# EAGLE design untitled (EAGLE 9.6.2)
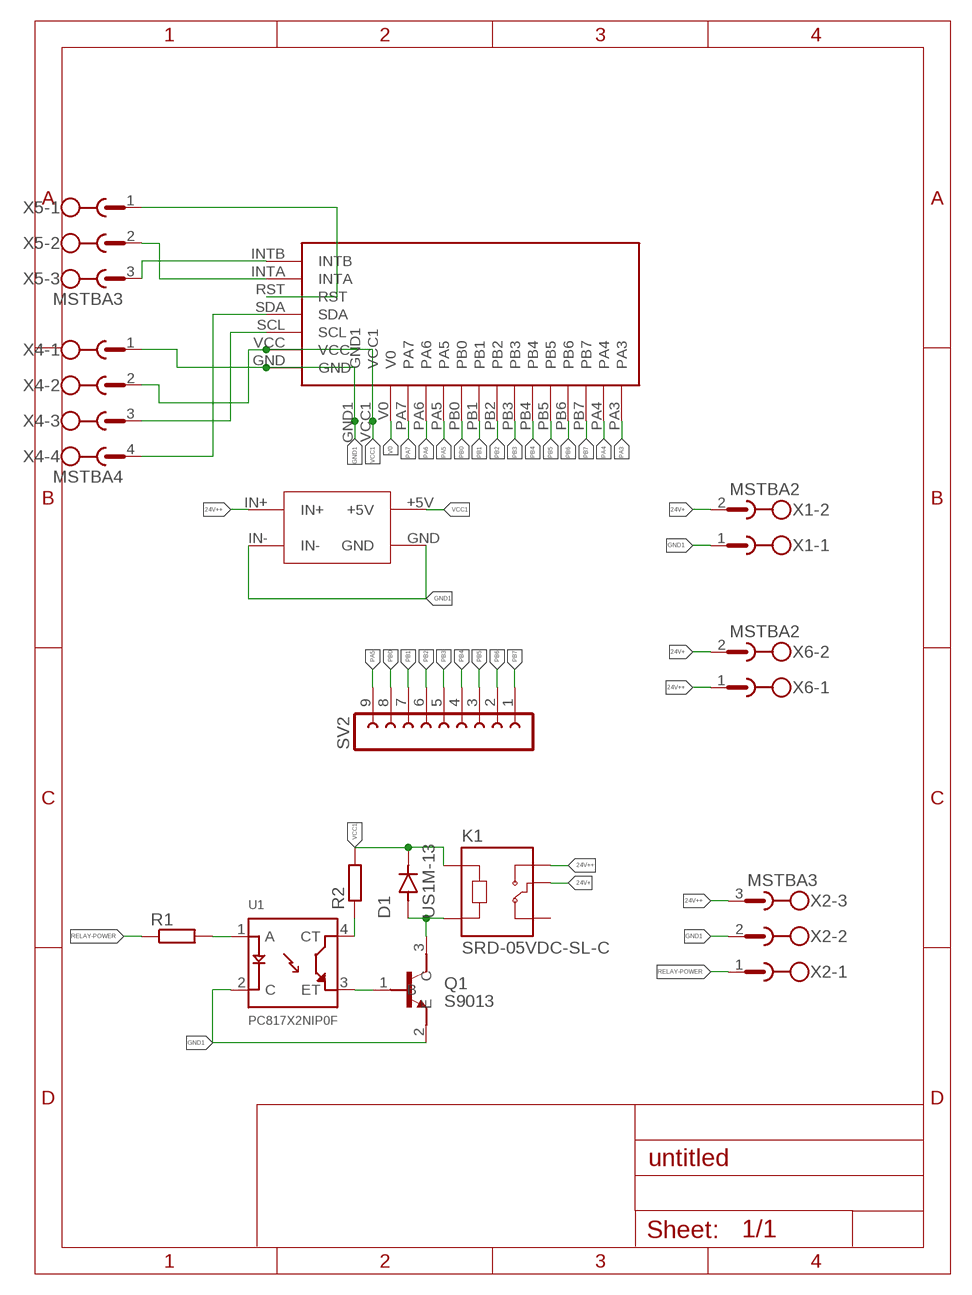
[diagram p0: schematic, sheet 1]

## Parts
D1  US1M-13  [DIOM5226X240N]
K1  SRD-05VDC-SL-C  [RELAY_SRD-05VDC-SL-C]
MCP23017-I2C1  MCP23017-I2C  [MCP23017-I2C]
Q1  S9013  [SOT95P240X120-3N]
R1  R-EU_R0805  [R0805]
R2  R-EU_R0805  [R0805]
SUPER-STEPDOWN1  SUPER-STEPDOWN  [SUPER-STEPDOWN]
SV2  FE09-1  [FE09]
U1  PC817X2NIP0F  [SOT254P975X400-4N]
X1  MSTBA2  [MSTBA2]
X2  MSTBA3  [MSTBA3]
X4  MSTBA4  [MSTBA4]
X5  MSTBA3  [MSTBA3]
X6  MSTBA2  [MSTBA2]

## Nets
24V+: K1.COM X1.2 X6.2
24V++: K1.NO SUPER-STEPDOWN1.IN+ X2.3 X6.1
GND1: MCP23017-I2C1.GND MCP23017-I2C1.GND1 Q1.2(E) SUPER-STEPDOWN1.GND SUPER-STEPDOWN1.IN- U1.2(C) X1.1 X2.2 X4.1
N$1: MCP23017-I2C1.RST X5.1
N$2: MCP23017-I2C1.SCL X4.3
N$3: MCP23017-I2C1.SDA X4.4
N$4: MCP23017-I2C1.INTB X5.3
N$5: MCP23017-I2C1.INTA X5.2
N$8: R2.1 U1.4(CT)
N$9: Q1.1(B) U1.3(ET)
N$11: R1.2 U1.1(A)
N$12: D1.A K1.A2 Q1.3(C)
PA3: MCP23017-I2C1.PA3
PA4: MCP23017-I2C1.PA4
PA5: MCP23017-I2C1.PA5 SV2.9
PA6: MCP23017-I2C1.PA6
PA7: MCP23017-I2C1.PA7
PB0: MCP23017-I2C1.PB0 SV2.8
PB1: MCP23017-I2C1.PB1 SV2.7
PB2: MCP23017-I2C1.PB2 SV2.6
PB3: MCP23017-I2C1.PB3 SV2.5
PB4: MCP23017-I2C1.PB4 SV2.4
PB5: MCP23017-I2C1.PB5 SV2.3
PB6: MCP23017-I2C1.PB6 SV2.2
PB7: MCP23017-I2C1.PB7 SV2.1
RELAY-POWER: R1.1 X2.1
V0: MCP23017-I2C1.V0
VCC1: D1.C(K) K1.A1 MCP23017-I2C1.VCC MCP23017-I2C1.VCC1 R2.2 SUPER-STEPDOWN1.+5V X4.2
Unconnected: K1.NC

## Library data of the parts
D1 = US1M-13:US1M-13: Diode, Fast Recovery, 1a, 1kv, Do-214ac-2, Full Reel Check availability <https://pricing.snapeda.com/parts/US1M-13/Diodes%20Incorporated/view-part?ref=eda>; AVAILABILITY: In Stock; DESCRIPTION: Diode Standard 1000 V 1A Surface Mount SMA; MF: Diodes Incorporated; MP: US1M-13; PACKAGE: DO-214AC-214 Diodes Incorporated; PRICE: None; PURCHASE-URL: https://pricing.snapeda.com/search/part/US1M-13/?ref=eda
K1 = SRD-05VDC-SL-C:SRD-05VDC-SL-C: 5V Trigger Relay Module For Arduino And Raspberry Pi 5V Trigger Relay Module For Arduino And Raspberry Pi Check availability <https://pricing.snapeda.com/parts/SRD-05VDC-SL-C/Songle%20Relay/view-part?ref=eda>; AVAILABILITY: Not in stock; DESCRIPTION: 5V Trigger Relay Module For Arduino And Raspberry Pi 5V Trigger Relay Module For Arduino And Raspberry Pi; MF: Songle Relay; MP: SRD-05VDC-SL-C; PACKAGE: NON STANDARD-5 Songle Relay; PRICE: None
MCP23017-I2C1 = MCP23017-I2C:MCP23017-I2C
Q1 = S9013:S9013: SMD Transistors NPN 25V-500mA Check availability <https://pricing.snapeda.com/parts/S9013/JCET/view-part?ref=eda>; AVAILABILITY: In Stock; DESCRIPTION: Bipolar (BJT) Transistor NPN 20V 500mA 625mW Through Hole TO-92-3; MF: JCET; MP: S9013; PACKAGE: SOT-23-3 JCET; PRICE: None; PURCHASE-URL: https://pricing.snapeda.com/search/part/S9013/?ref=eda
R1 R2 = rcl:R-EU_: RESISTOR, European symbol; SPICEPREFIX: R
SUPER-STEPDOWN1 = SUPER-STEPDOWN:SUPER-STEPDOWN
SV2 = con-lsta:FE09-1: FEMALE HEADER; OC_FARNELL: unknown; OC_NEWARK: unknown
U1 = PC817X2NIP0F:PC817X2NIP0F: PC817 Series 1 Channel 80 V 5000 Vrms General Purpose Photocoupler - DIP-4 Check availability <https://pricing.snapeda.com/parts/PC817X2NIP0F/Sharp%20Microelectronics/view-part?ref=eda>; AVAILABILITY: Not in stock; DESCRIPTION: Optoisolator Transistor Output 5000Vrms 1 Channel 4-SMD; MF: Sharp Microelectronics; MP: PC817X2NIP0F; PACKAGE: SMD-4 Sharp Microelectronics; PRICE: None
X1 X6 = con-phoenix-508:MSTBA2: PHOENIX; MF: FARNELL; MPN: 1757242; OC_FARNELL: 3705171; OC_NEWARK: 71C4161
X2 X5 = con-phoenix-508:MSTBA3: PHOENIX; MF: FARNELL; MPN: 1757255; OC_FARNELL: 3705183; OC_NEWARK: 71C4162
X4 = con-phoenix-508:MSTBA4: PHOENIX; MF: FARNELL; MPN: 1757268; OC_FARNELL: 3705195; OC_NEWARK: 71C4163

## Board
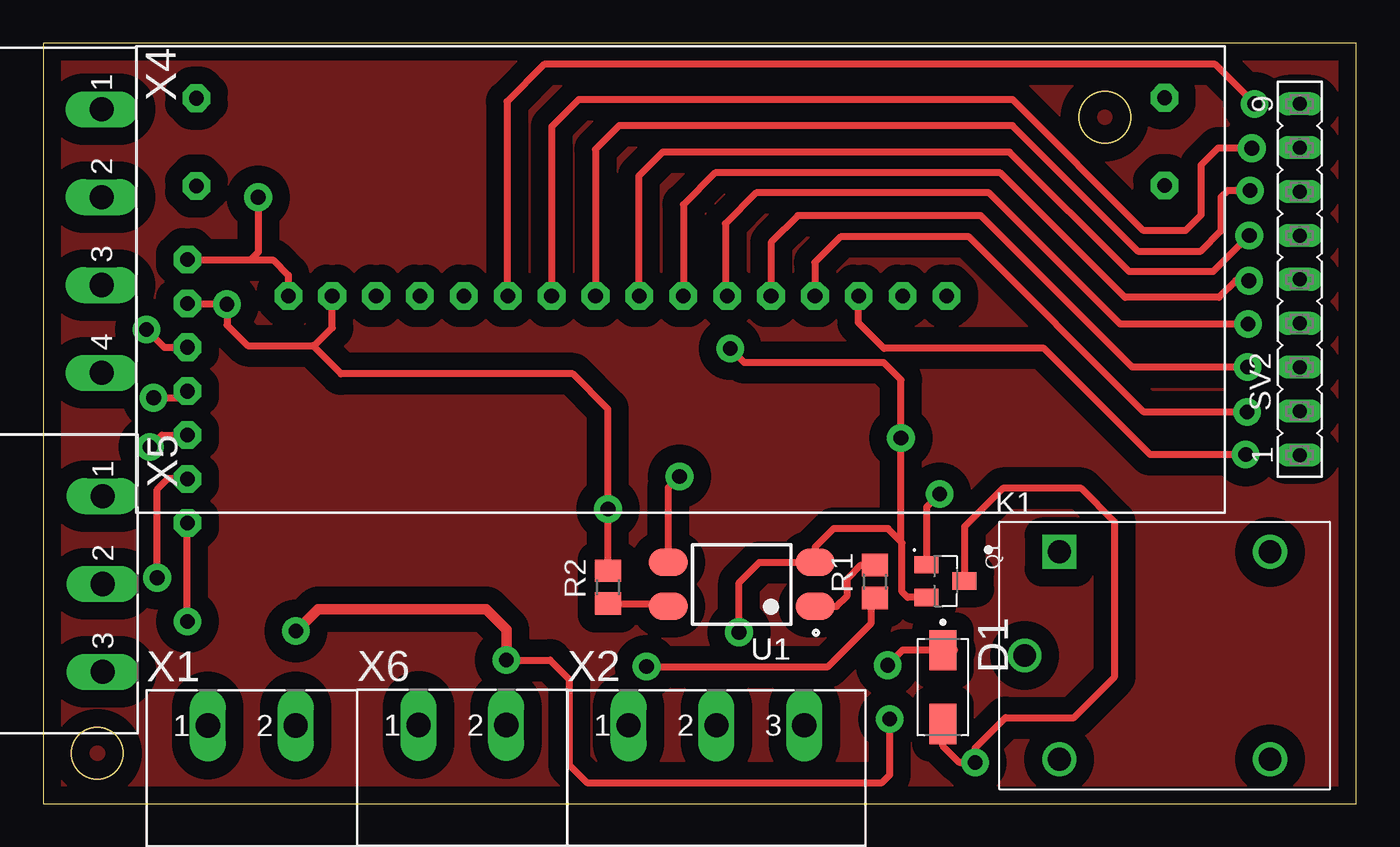
[diagram p1: board, top side]
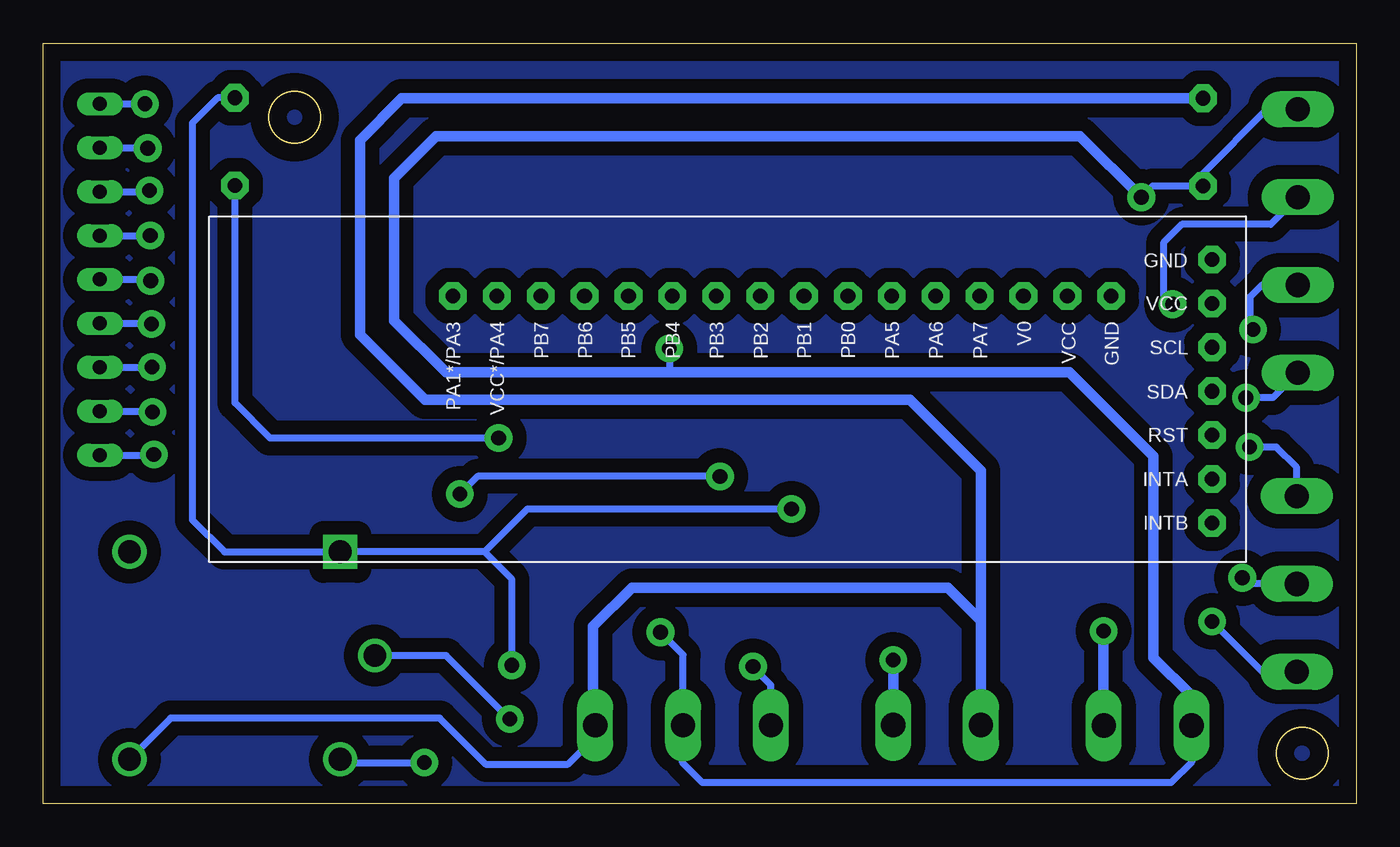
[diagram p2: board, bottom side, seen from below]

Size 76 x 44 mm. Coordinates in mm from the lower left corner, seen from the top.
Outline: 0,0 76,0 76,44 0,44 0,0
Outline: circle at 3.14,2.92 radius 1.5
Outline: circle at 61.45,39.72 radius 1.5
Copper layers (1*16): Top 0.035mm / dielectric 1.5mm / Bottom 0.035mm
Design rules "default": minimum track width 6mil, minimum drill 0.35mm, track to track 6mil, track to pad 6mil, pad to pad 6mil, via to via 6mil, smd to smd 6mil, copper to edge 40mil, drill to drill 6mil, minimum pad ring 10mil, minimum via ring 8mil, stop-mask expansion 4mil, vias tented up to drill 0mil, thermal gap 10mil

### Footprints (pad centres in the part's own frame; a part is rotated, then mirrored left to right if it is on the bottom)
DIOM5226X240N = smd 2.33 x 1.55: A 2.135,0; C -2.135,0
RELAY_SRD-05VDC-SL-C = drill 1.32 square: A1 -6.1,6 | drill 1.32: A2 -6.1,-6; NC 6.1,6; NO 6.1,-6 | drill 1.29: COM -8.1,0
MCP23017-I2C = drill 0.85 pad 1.6 octagon: GND -8.038,-13.51; GND1 -2.199,-11.404; INTA -8.038,-0.81; INTB -8.038,1.73; PA3 35.901,-11.404; PA4 33.361,-11.404; PA5 10.501,-11.404; PA6 7.961,-11.404; PA7 5.421,-11.404; PB0 13.041,-11.404; PB1 15.581,-11.404; PB2 18.121,-11.404; PB3 20.661,-11.404; PB4 23.201,-11.404; PB5 25.741,-11.404; PB6 28.281,-11.404; PB7 30.821,-11.404; RST -8.038,-3.35; SCL -8.038,-8.43; SDA -8.038,-5.89; V0 2.881,-11.404; VCC -8.038,-10.97; VCC1 0.341,-11.404
SOT95P240X120-3N = smd 1 x 1.4: 1 -0.95,-1.1; 2 0.95,-1.1; 3 0,1.1
R0805 = smd 1.3 x 1.5: 1 -0.95,0; 2 0.95,0
SUPER-STEPDOWN = drill 0.85 pad 1.6 octagon: +5V 59.509,24.006; GND 59.509,18.926; IN+ 3.478,23.979; IN- 3.478,18.899
FE09 = drill 0.813 long: 1 -10.16,0; 2 -7.62,0; 3 -5.08,0; 4 -2.54,0; 5 0,0; 6 2.54,0; 7 5.08,0; 8 7.62,0; 9 10.16,0
SOT254P975X400-4N = smd 2.25 x 1.6: 1 -4.25,1.27; 2 -4.25,-1.27; 3 4.25,-1.27; 4 4.25,1.27
MSTBA2 = drill 1.397 long: 1 -2.54,5.08; 2 2.54,5.08
MSTBA3 = drill 1.397 long: 1 -5.08,5.08; 2 0,5.08; 3 5.08,5.08
MSTBA4 = drill 1.397 long: 1 -7.62,5.08; 2 -2.54,5.08; 3 2.54,5.08; 4 7.62,5.08

### Placement (x,y rotation side)
D1  52.07,6.75 270 top
K1  64.91,8.57 0 top
MCP23017-I2C1  16.38,17.98 180 bottom
Q1  52.22,12.88 270 top
R1  48.14,12.85 90 top
R2  32.69,12.53 90 top
SUPER-STEPDOWN1  5.39,16.83 0 top
SV2  72.72,30.33 90 top
U1  40.43,12.69 180 top
X1  12.07,-0.55 0 top
X2  38.97,-0.54 0 top
X4  -1.7,32.55 270 top
X5  -1.63,12.71 270 top
X6  24.26,-0.53 0 top

### Tracks (layer width: path | path; a pad name or v marks a point on that pad's centre or on a via)
24V+  (via drill 0.85 pad 1.6)
  Top 0.406: v26.81,8.31 29.34,8.31 30.45,7.2 30.45,2.24 31.47,1.22 48.55,1.22 49,1.66 v49,4.9
  Top 0.61: v26.81,8.31 26.81,10.08 25.62,11.26 15.91,11.26 v14.63,9.99
  Bottom 0.406: v49,4.9 52.67,8.57 K1.COM
  Bottom 0.61: X6.2 v26.8,8.31 v26.81,8.31 | v14.63,9.99 14.63,4.54 X1.2
24V++
  Bottom 0.406: K1.NO 68.63,4.95 53.05,4.95 50.36,2.26 45.66,2.26 44.05,3.87 X2.3
  Bottom 0.61: X2.3 44.17,4.67 44.17,10.26 41.92,12.51 23.63,12.51 21.72,10.6 X6.1 21.72,19.26 25.84,23.38 53.91,23.38 57.66,27.13 57.66,38.4 55.24,40.81 SUPER-STEPDOWN1.IN+
GND1  (via drill 0.85 pad 1.6)
  Top 0.406: v12.44,35.08 12.44,31.92 11.99,31.47 | 11.99,31.47 8.37,31.47 MCP23017-I2C1.GND | 11.99,31.47 13.3,31.47 14.19,30.58 MCP23017-I2C1.GND1 | v40.27,9.92 40.27,12.79 41.44,13.96 U1.2 44.68,14.84 45.75,15.91 48.9,15.91 49.65,15.16 | Q1.2 50.03,11.93 49.71,12.25 49.71,15.1 49.65,15.16 | 49.65,15.16 v49.65,21.16 49.65,24.52 48.65,25.52 40.59,25.52 v39.77,26.34 v39.76,26.33
  Bottom 0.406: v12.44,35.08 11.79,35.73 SUPER-STEPDOWN1.IN- 8.87,36.48 5.17,40.17 X4.1 | X1.1 9.53,2.41 10.72,1.22 37.85,1.22 38.99,2.36 38.99,4.52 X2.2 38.97,8.61 v40.27,9.92 | v39.76,26.33 39.76,25.02 39.7,24.96 | v49.65,21.16 62.87,21.16 64.9,23.18 SUPER-STEPDOWN1.GND
  Bottom 0.61: X1.1 9.53,6.25 11.73,8.45 11.73,20.11 16.59,24.96 39.7,24.96 52.69,24.96 55.68,27.95 55.68,36.2 53.25,38.63 15.99,38.63 v12.44,35.08
N$1  (via drill 0.85 pad 1.6)
  Top 0.406: v6.17,20.63 6.87,21.33 MCP23017-I2C1.RST
  Bottom 0.406: X5.1 3.45,19.46 4.63,20.63 v6.17,20.63
N$2  (via drill 0.85 pad 1.6)
  Top 0.406: v5.98,27.44 7.01,26.41 MCP23017-I2C1.SCL
  Bottom 0.406: X4.3 5.46,30.01 6.17,29.3 6.17,27.62 v5.98,27.44
N$3  (via drill 0.85 pad 1.6)
  Top 0.406: v6.39,23.49 7.97,23.49 MCP23017-I2C1.SDA
  Bottom 0.406: X4.4 4.82,23.49 v6.39,23.49
N$4  (via drill 0.85 pad 1.6)
  Top 0.406: v8.35,10.55 MCP23017-I2C1.INTB
  Bottom 0.406: X5.3 5.44,7.63 v8.35,10.55
N$5  (via drill 0.85 pad 1.6)
  Top 0.406: v6.6,13.07 6.6,18.19 7.23,18.82 8.32,18.82 MCP23017-I2C1.INTA
  Bottom 0.406: X5.2 6.24,12.71 v6.6,13.07
N$6
  pour Bottom (isolate 0.813): 0,44 76,44 76,0 0,0
N$7
  pour Top (isolate 1.016): 0,44 76,44 76,0 0,0
N$8
  Top 0.406: R2.1 36.02,11.58 U1.4
N$9  (via drill 0.85 pad 1.6)
  Top 0.406: U1.3 36.18,18.29 v36.83,18.94 | v51.89,17.92 51.12,17.15 Q1.1
  Bottom 0.406: v36.83,18.94 50.87,18.94 v51.89,17.92
N$11
  Top 0.406: U1.1 45.92,11.42 46.54,12.03 46.54,13.02 47.33,13.81 48.13,13.81 R1.2
N$12  (via drill 0.85 pad 1.6)
  Top 0.406: D1.A 52.07,3.33 53.03,2.38 v53.94,2.38 53.94,3.23 55.7,4.98 59.65,4.98 62.02,7.36 62.02,16.3 60.08,18.25 55.54,18.25 53.32,16.03 Q1.3
  Bottom 0.406: K1.A2 58.62,2.38 v53.94,2.38
PA5  (via drill 0.85 pad 1.6)
  Top 0.406: v70.12,40.49 67.83,42.78 28.99,42.78 26.84,40.62 26.84,29.43 MCP23017-I2C1.PA5
  Bottom 0.406: SV2.9 v70.12,40.49 70.02,40.4
PB0  (via drill 0.85 pad 1.6)
  Top 0.406: v69.95,37.93 67.99,37.93 67.01,36.95 67.01,34.05 66.11,33.16 63.69,33.16 56.11,40.73 30.99,40.73 29.43,39.17 MCP23017-I2C1.PB0
  Bottom 0.406: SV2.8 70.01,37.95 69.97,37.91 v69.95,37.93
PB1  (via drill 0.85 pad 1.6)
  Top 0.406: v69.86,35.47 68.55,35.47 68.17,35.09 68.17,33.14 66.97,31.94 63.39,31.94 56.09,39.23 33.34,39.23 31.97,37.86 MCP23017-I2C1.PB1
  Bottom 0.406: SV2.7 69.92,35.41 v69.86,35.47 | v69.86,35.47
PB2  (via drill 0.85 pad 1.6)
  Top 0.406: v69.81,32.88 67.71,30.78 62.85,30.78 55.93,37.7 35.85,37.7 34.46,36.31 34.46,29.43 MCP23017-I2C1.PB2
  Bottom 0.406: SV2.6 v69.81,32.87 v69.8,32.88 v69.81,32.88
PB3  (via drill 0.85 pad 1.6)
  Top 0.406: v69.78,30.26 69.02,30.26 68.05,29.29 62.61,29.29 55.4,36.5 38.88,36.5 37.05,34.66 MCP23017-I2C1.PB3
  Bottom 0.406: SV2.5 69.84,30.33 v69.78,30.27 v69.78,30.26 | v69.78,30.26
PB4  (via drill 0.85 pad 1.6)
  Top 0.406: v69.74,27.75 62.33,27.75 54.74,35.35 41.27,35.35 39.49,33.57 39.49,29.48 MCP23017-I2C1.PB4
  Bottom 0.406: SV2.4 69.72,27.79 69.72,27.77 v69.74,27.75
PB5  (via drill 0.85 pad 1.6)
  Top 0.406: v69.7,25.26 63.03,25.26 54.26,34.02 43.68,34.02 42.13,32.47 MCP23017-I2C1.PB5
  Bottom 0.406: SV2.3 69.72,25.25 v69.7,25.27 v69.7,25.26
PB6  (via drill 0.85 pad 1.6)
  Top 0.406: v69.68,22.66 63.72,22.66 53.58,32.8 46.15,32.8 44.67,31.32 MCP23017-I2C1.PB6
  Bottom 0.406: SV2.2 69.71,22.71 69.68,22.68 v69.68,22.66
PB7  (via drill 0.85 pad 1.6)
  Top 0.406: v69.6,20.2 64.07,20.2 57.93,26.34 48.67,26.34 47.17,27.84 47.17,29.35 MCP23017-I2C1.PB7
  Bottom 0.406: SV2.1 69.62,20.17 v69.6,20.2
RELAY-POWER  (via drill 0.85 pad 1.6)
  Top 0.406: v34.92,7.94 45.43,7.94 47.94,10.44 47.94,11.69 R1.1
  Bottom 0.406: X2.1 33.89,6.85 34.95,7.91 v34.92,7.94
VCC1  (via drill 0.85 pad 1.6)
  Top 0.406: MCP23017-I2C1.VCC 8.4,28.89 v10.64,28.89 10.64,27.69 11.84,26.5 15.61,26.5 15.66,26.46 | MCP23017-I2C1.VCC1 16.73,27.53 15.66,26.46 | 15.66,26.46 17.24,24.87 30.65,24.87 32.69,22.83 v32.69,17.06 R2.2 32.66,13.51 | 52.74,8.88 D1.C 49.74,8.88 v48.87,8.01
  Bottom 0.406: X4.2 4.96,33.51 10.09,33.51 11.16,32.44 11.16,29.43 10.64,28.91 v10.64,28.89 | SUPER-STEPDOWN1.+5V 65.9,40.84 67.36,39.38 67.36,16.43 65.51,14.57 K1.A1 50.46,14.57 | v48.87,8.01 48.87,12.98 50.46,14.57 | 50.46,14.57 47.98,17.06 v32.69,17.06 32.58,17.06